# EAGLE schematic eom (EAGLE 9.3.0)
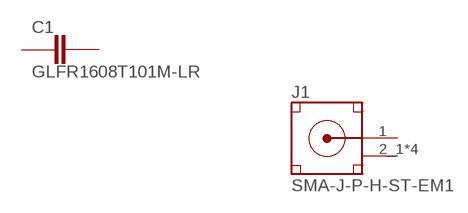
[diagram p0: schematic, sheet 1]

## Parts
C1  GLFR1608T101M-LR  [CAPC1608X95]
J1  SMA-J-P-H-ST-EM1  [SMA-J-P-H-ST-EM1]
Unconnected: C1.1 C1.2 J1.1(SIGNAL)

## Power pins joined to a net without a drawn wire
GND: J1.2_1(GND) J1.2_2(GND) J1.3_1(GND) J1.3_2(GND)

## Library data of the parts
C1 = GLFR1608T101M-LR:GLFR1608T101M-LR: FIXED IND 100UH 80MA 5.5 OHM SMD; DESCRIPTION: Inductor Power Chip Shielded Wirewound 100uH 20% 80mA 5.5Ohm DCR 0603 T/R; DIGI-KEY_PART_NUMBER: 445-6150-1-ND; DIGI-KEY_PURCHASE_URL: https://www.digikey.com/product-detail/en/tdk-corporation/GLFR1608T101M-LR/445-6150-1-ND/2465476?utm_source=snapeda&utm_medium=aggregator&utm_campaign=symbol; MF: TDK; MP: GLFR1608T101M-LR; PACKAGE: 0603 TDK
J1 = SMA-J-P-H-ST-EM1:SMA-J-P-H-ST-EM1: Connector SMA F 50Ohm Solder ST Edge Mount Gold Over Nickel Tray; DESCRIPTION: Connector SMA F 50Ohm Solder ST Edge Mount Gold Over Nickel Tray; DIGI-KEY_PART_NUMBER: SAM8857-ND; DIGI-KEY_PURCHASE_URL: https://www.digikey.com/product-detail/en/samtec-inc/SMA-J-P-H-ST-EM1/SAM8857-ND/2602450?utm_source=snapeda&utm_medium=aggregator&utm_campaign=symbol; MF: Samtec; MP: SMA-J-P-H-ST-EM1; PACKAGE: None